# Altium schematic sheet ASBB_VIN.SchDoc
size A4
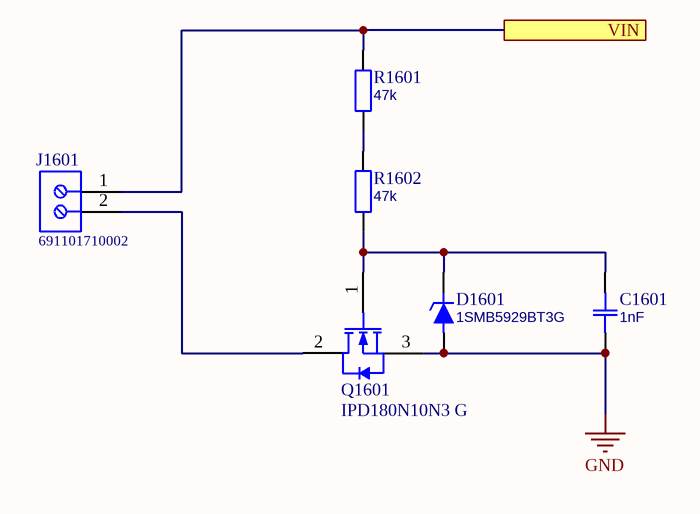
[diagram p0: ASBB_VIN.SchDoc]

## Parts
C1601  1nF  [0603]
D1601  1SMB5929BT3G  [SMB]
J1601  691101710002  [691101710002]
Q1601  IPD180N10N3 G  [INF-PG-TO252-3-11_A_N]
R1601  47k  [0603]
R1602  47k  [0603]

## Ports
VIN

## Nets
GND: C1601.2 D1601.2(A) Q1601.3(SOURCE)
VIN: J1601.1 R1601.2 ; port VIN
NetC1601_1: C1601.1 D1601.1(C) Q1601.1(GATE) R1602.1
NetJ1601_2: J1601.2 Q1601.2(DRAIN)
NetR1601_1: R1601.1 R1602.2

## Library data of the parts
C1601 = Capacitor: Partnumber: ?; Value: ?
D1601 = Diode Zener: Zener Diode / Varistor unipolar; Partnumber: ?; Value: ?
J1601 = 691101710002: Series 101 - 5.00 mm Horizontal Entry Modular with Pressure Clamp WR-TBL, 2 pin; Pin Number: 2; Pitch: 5.00 mm; ComponentLink1Description: Manufacturer; ComponentLink1URL: http://www.we-online.de; ComponentLink2Description: Datasheet; ComponentLink2URL: http://katalog.we-online.de/em/datasheet/6911017100xx.pdf; Part Number: 691101710002; Published Date: May 2018; Publisher: Wurth Elektronik; Operating Temperature: -40 to 105 degC; Mounting Technology: THT; Packaging: Box
Q1601 = IPD180N10N3 G: N-Channel OptiMOS 3 Power-Transistor, 100 V VDS, 43 A ID, -55 to 175 degC, PG-TO252-3-11, Reel, Green; Manufacturer: Infineon; Green: TRUE; ID (max): 43 A; IDpuls (max): 172 A; Polarity: N; Ptot (max): 71 W; QG: 19 nC; RDS (on) (max): 18 mOhm; Rth: 2.1 K/W; RthJA (max): 75 K/W; VDS (max): 100 V; VGS(th) (max): 3.5 V; VGS(th) (min): 2 V; DatasheetVersion: Rev. 2.2; PackageVersion: Rev. 02, 03/2007; PackageReference: PG-TO252-3-11; PackageDescription: 3-Pin Plastic (Green) Transistor Single Outline Package, 6.57 x 6.1 mm Body, 2.29 mm Pitch; Supplier 1: Digi-Key; Supplier Part Number 1: IPD180N10N3 GTR-ND; Supplier 2: Digi-Key; Supplier Part Number 2: IPD180N10N3 GCT-ND; Supplier 3: Digi-Key; Supplier Part Number 3: IPD180N10N3 GDKR-ND; Packing: Reel; RthJC (max): 2.1 K/W; Mounting Technology: Surface Mount; PartNumber: IPD180N10N3 G; ComponentLink1Description: Manufacturer URL; ComponentLink1URL: http://www.infineon.com/; ComponentLink2Description: Datasheet; ComponentLink2URL: http://www.infineon.com/dgdl/IPD180N10N3+G_Rev2.2.pdf?folderId=db3a304313b8b5a60113cee8763b02d7&fileId=db3a30432239cccd01226070a4bb7fb9; ComponentLink3Description: Package Specification; ComponentLink3URL: http://www.infineon.com/dgdl/IPD160N04L_rev1.0.pdf?folderId=db3a3043163797a6011643468e7505a4&fileId=db3a3043163797a60116436401cf05cf
R1601 R1602 = Resistor: Partnumber: ?; Value: ?